# EAGLE design motorcontrol (EAGLE 7.7.0)
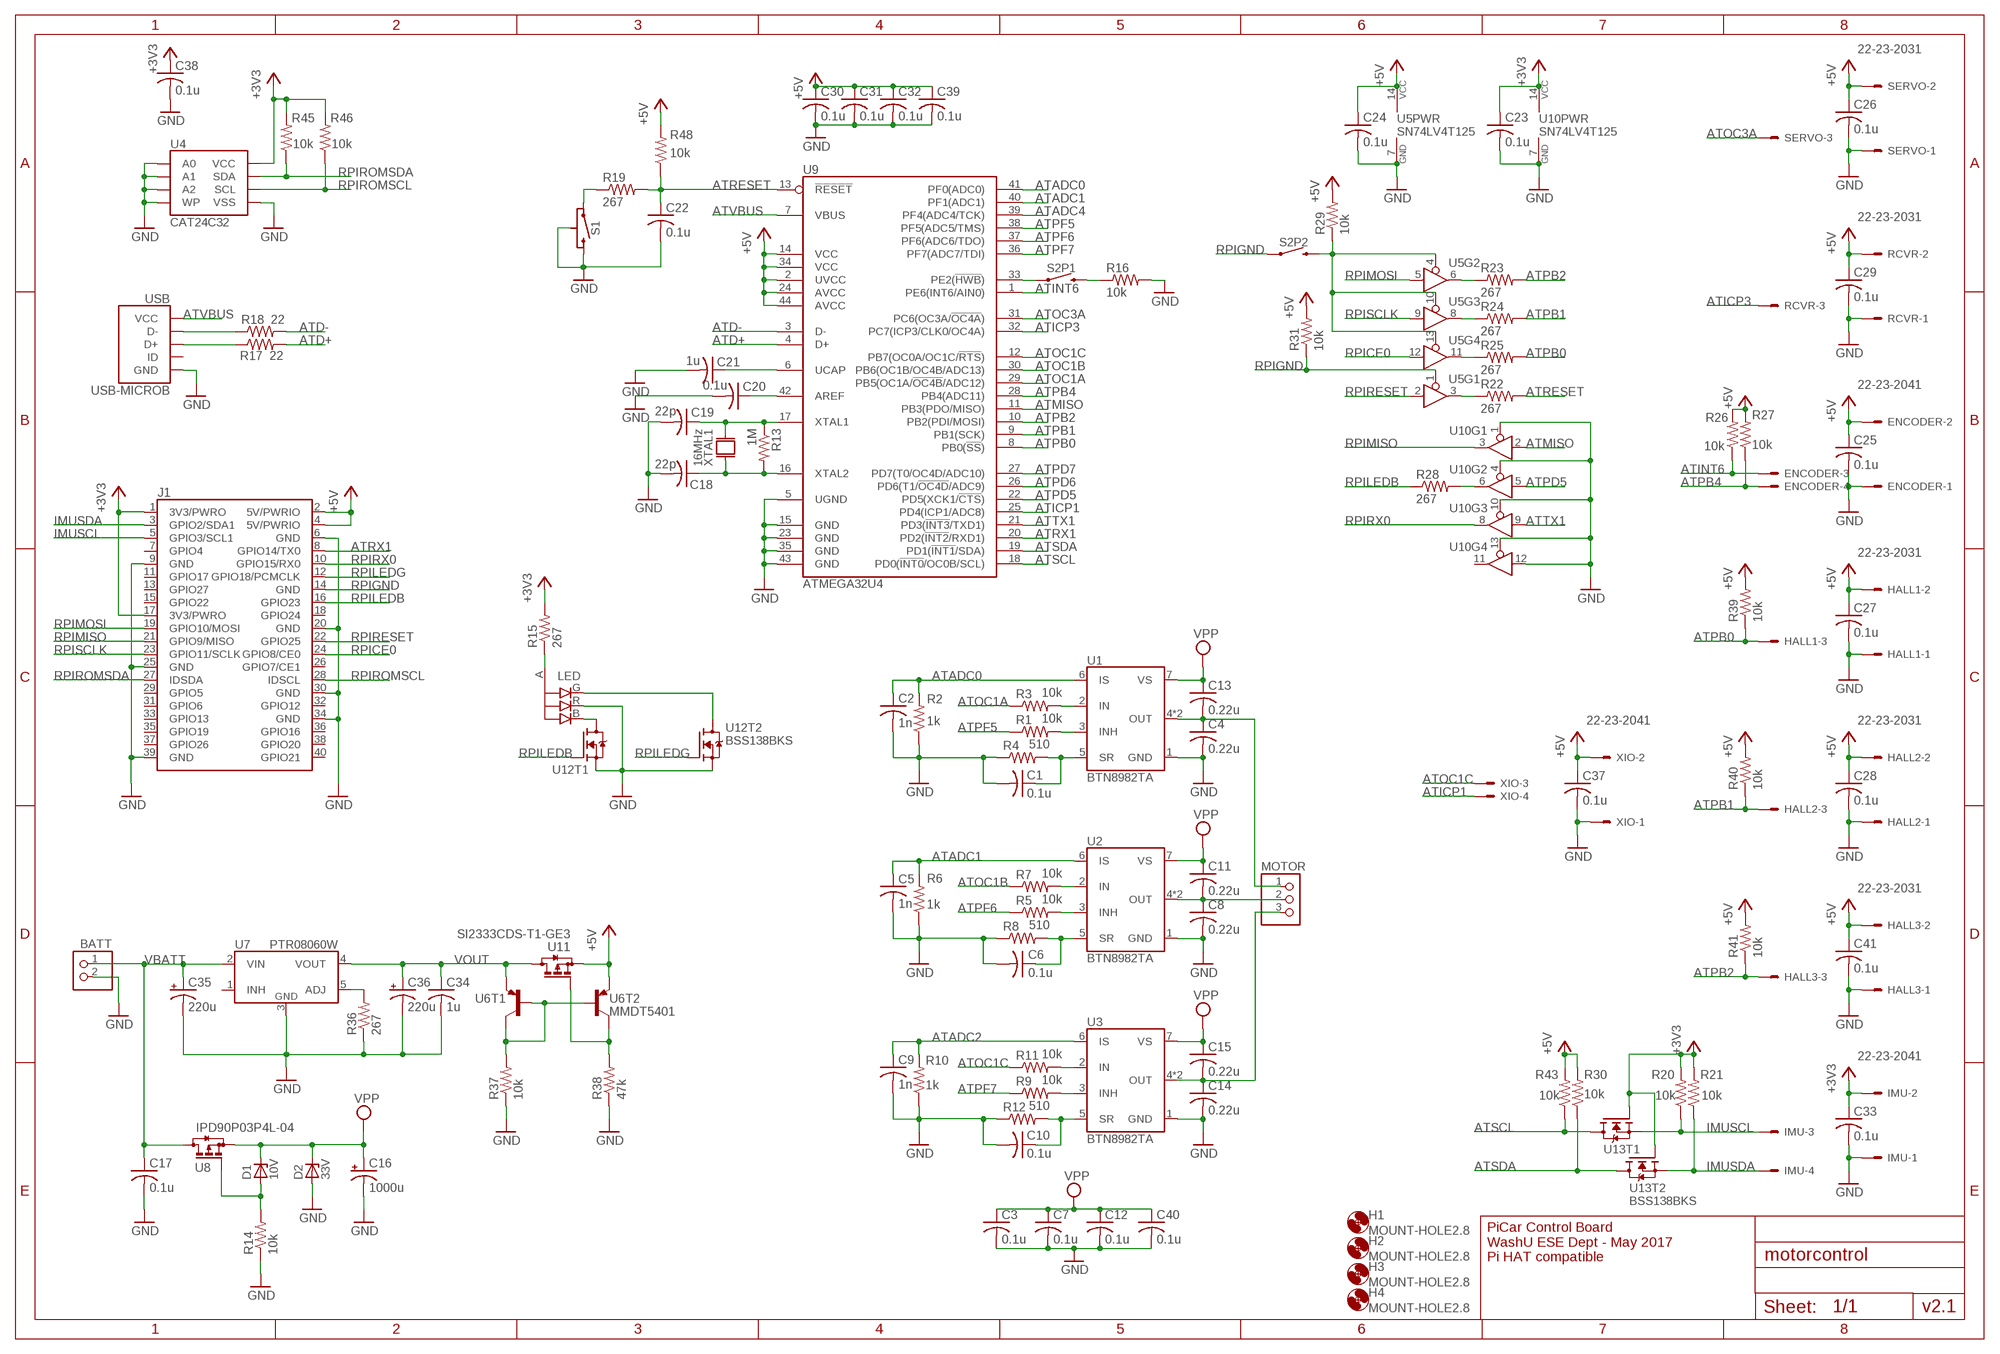
[diagram p0: schematic, sheet 1]

## Parts
BATT  ULTRAFIT_2CIRCVCLIP  [ULTRAFIT_2CIRC_VERTCLIP]
C1  0.1u  C-USC1206  [C1206]
C2  1n  C-USC1206  [C1206]
C3  0.1u  C-USC1206  [C1206]
C4  0.22u  C-USC1206  [C1206]
C5  1n  C-USC1206  [C1206]
C6  0.1u  C-USC1206  [C1206]
C7  0.1u  C-USC1206  [C1206]
C8  0.22u  C-USC1206  [C1206]
C9  1n  C-USC1206  [C1206]
C10  0.1u  C-USC1206  [C1206]
C11  0.22u  C-USC1206  [C1206]
C12  0.1u  C-USC1206  [C1206]
C13  0.22u  C-USC1206  [C1206]
C14  0.22u  C-USC1206  [C1206]
C15  0.22u  C-USC1206  [C1206]
C16  1000u  CPOL-USE5-10.5  [E5-10,5]
C17  0.1u  C-USC1206  [C1206]
C18  22p  C-USC1206  [C1206]
C19  22p  C-USC1206  [C1206]
C20  0.1u  C-USC1206  [C1206]
C21  1u  C-USC1206  [C1206]
C22  0.1u  C-USC1206  [C1206]
C23  0.1u  C-USC1206  [C1206]
C24  0.1u  C-USC1206  [C1206]
C25  0.1u  C-USC1206  [C1206]
C26  0.1u  C-USC1206  [C1206]
C27  0.1u  C-USC1206  [C1206]
C28  0.1u  C-USC1206  [C1206]
C29  0.1u  C-USC1206  [C1206]
C30  0.1u  C-USC1206  [C1206]
C31  0.1u  C-USC1206  [C1206]
C32  0.1u  C-USC1206  [C1206]
C33  0.1u  C-USC1206  [C1206]
C34  1u  C-USC1206  [C1206]
C35  220u  CPOL-USE3.5-8  [E3,5-8]
C36  220u  CPOL-USE3.5-8  [E3,5-8]
C37  0.1u  C-USC1206  [C1206]
C38  0.1u  C-USC1206  [C1206]
C39  0.1u  C-USC1206  [C1206]
C40  0.1u  C-USC1206  [C1206]
C41  0.1u  C-USC1206  [C1206]
D1  10V  ZENER_DIODESOD123  [SOD123]
D2  33V  ZENER_DIODESMA  [SMA]
ENCODER  22-23-2041  [22-23-2041]
H1  MOUNT-HOLE2.8  [2,8]
H2  MOUNT-HOLE2.8  [2,8]
H3  MOUNT-HOLE2.8  [2,8]
H4  MOUNT-HOLE2.8  [2,8]
HALL1  22-23-2031  [22-23-2031]
HALL2  22-23-2031  [22-23-2031]
HALL3  22-23-2031  [22-23-2031]
IMU  22-23-2041  [22-23-2041]
J1  RPIHEADER_2.54-SMD  [RPI_SMD]
LED  LED_3COLOR_COMMONA1411  [150141M173100]
MOTOR  ULTRAFIT_3CIRCVCLIP  [ULTRAFIT_3CIRC_VERTCLIP]
R1  10k  R-US_R1206  [R1206]
R2  1k  R-US_R1206  [R1206]
R3  10k  R-US_R1206  [R1206]
R4  510  R-US_R1206  [R1206]
R5  10k  R-US_R1206  [R1206]
R6  1k  R-US_R1206  [R1206]
R7  10k  R-US_R1206  [R1206]
R8  510  R-US_R1206  [R1206]
R9  10k  R-US_R1206  [R1206]
R10  1k  R-US_R1206  [R1206]
R11  10k  R-US_R1206  [R1206]
R12  510  R-US_R1206  [R1206]
R13  1M  R-US_R1206  [R1206]
R14  10k  R-US_R1206  [R1206]
R15  267  R-US_R1206  [R1206]
R16  10k  R-US_R1206  [R1206]
R17  22  R-US_R1206  [R1206]
R18  22  R-US_R1206  [R1206]
R19  267  R-US_R1206  [R1206]
R20  10k  R-US_R1206  [R1206]
R21  10k  R-US_R1206  [R1206]
R22  267  R-US_R1206  [R1206]
R23  267  R-US_R1206  [R1206]
R24  267  R-US_R1206  [R1206]
R25  267  R-US_R1206  [R1206]
R26  10k  R-US_R1206  [R1206]
R27  10k  R-US_R1206  [R1206]
R28  267  R-US_R1206  [R1206]
R29  10k  R-US_R1206  [R1206]
R30  10k  R-US_R1206  [R1206]
R31  10k  R-US_R1206  [R1206]
R36  267  R-US_R1206  [R1206]
R37  10k  R-US_R1206  [R1206]
R38  47k  R-US_R1206  [R1206]
R39  10k  R-US_R1206  [R1206]
R40  10k  R-US_R1206  [R1206]
R41  10k  R-US_R1206  [R1206]
R43  10k  R-US_R1206  [R1206]
R45  10k  R-US_R1206  [R1206]
R46  10k  R-US_R1206  [R1206]
R48  10k  R-US_R1206  [R1206]
RCVR  22-23-2031  [22-23-2031]
S1  SWITCH-GND  [B3F-312X]
S2  A6HF-2DIP  [A6HF-2DIP]
SERVO  22-23-2031  [22-23-2031]
U1  BTN8982TA  [TO263-7]
U2  BTN8982TA  [TO263-7]
U3  BTN8982TA  [TO263-7]
U4  CAT24C32  [SOIC8]
U5  SN74LV4T125  [TSSOP14]
U6  MMDT5401  [SOT363]
U7  PTR08060W  [EDP_MODULE]
U8  IPD90P03P4L-04  [TO252-3-11]
U9  ATMEGA32U4  [TQFP44]
U10  SN74LV4T125  [TSSOP14]
U11  SI2333CDS-T1-GE3  [SOT23-3]
U12  BSS138BKS  [SOT363]
U13  BSS138BKS  [SOT363]
USB  USB-MICROB  [FCI-10103594-0001LF]
XIO  22-23-2041  [22-23-2041]
XTAL1  16MHz  XTALABLS7M2  [ABLS7M2]

## Nets
+3V3: C23.1 C33.1 C38.1 IMU.2 J1.1(3V3/PWRO) J1.17(3V3/PWRO) R15.2 R20.2 R21.2 R45.2 R46.2 U4.8(VCC) U10.14(PWR:VCC) U13.2(T1:G) U13.5(T2:G)
+5V: C24.1 C25.1 C26.1 C27.1 C28.1 C29.1 C30.1 C31.1 C32.1 C37.1 C39.1 C41.1 ENCODER.2 HALL1.2 HALL2.2 HALL3.2 J1.2(5V/PWRIO) J1.4(5V/PWRIO) R26.2 R27.2 R29.2 R30.2 R31.2 R39.2 R40.2 R41.2 R43.2 R48.2 RCVR.2 SERVO.2 U5.14(PWR:VCC) U6.4(T2:E) U9.2(UVCC) U9.14(VCC) U9.24(AVCC) U9.34(VCC) U9.44(AVCC) U11.2(S) XIO.2
ATADC0: C2.1 R2.2 U1.6(IS) U9.41(PF0(ADC0))
ATADC1: C5.1 R6.2 U2.6(IS) U9.40(PF1(ADC1))
ATADC2: C9.1 R10.2 U3.6(IS)
ATADC4: U9.39(PF4(ADC4/TCK))
ATD+: R17.2 U9.4(D+)
ATD-: R18.2 U9.3(D-)
ATICP1: U9.25(PD4(ICP1/ADC8)) XIO.4
ATICP3: RCVR.3 U9.32(PC7(ICP3/CLK0/OC4A))
ATINT6: ENCODER.3 R26.1 U9.1(PE6(INT6/AIN0))
ATMISO: U9.11(PB3(PDO/MISO)) U10.2(I)
ATOC1A: R3.1 U9.29(PB5(OC1A/!OC4B!/ADC12))
ATOC1B: R7.1 U9.30(PB6(OC1B/OC4B/ADC13))
ATOC1C: R11.1 U9.12(PB7(OC0A/OC1C/!RTS!)) XIO.3
ATOC3A: SERVO.3 U9.31(PC6(OC3A/!OC4A!))
ATPB0: HALL1.3 R25.2 R39.1 U9.8(PB0(!SS!))
ATPB1: HALL2.3 R24.2 R40.1 U9.9(PB1(SCK))
ATPB2: HALL3.3 R23.2 R41.1 U9.10(PB2(PDI/MOSI))
ATPB4: ENCODER.4 R27.1 U9.28(PB4(ADC11))
ATPD5: U9.22(PD5(XCK1/!CTS!)) U10.5(I)
ATPD6: U9.26(PD6(T1/!OC4D!/ADC9))
ATPD7: U9.27(PD7(T0/OC4D/ADC10))
ATPF5: R1.1 U9.38(PF5(ADC5/TMS))
ATPF6: R5.1 U9.37(PF6(ADC6/TDO))
ATPF7: R9.1 U9.36(PF7(ADC7/TDI))
ATRESET: C22.1 R19.2 R22.2 R48.1 U9.13(!RESET!)
ATRX1: J1.8(GPIO14/TX0) U9.20(PD2(!INT2!/RXD1))
ATSCL: R43.1 U9.18(PD0(!INT0!/OC0B/SCL)) U13.6(T1:D)
ATSDA: R30.1 U9.19(PD1(!INT1!/SDA)) U13.3(T2:D)
ATTX1: U9.21(PD3(!INT3!/TXD1)) U10.9(I)
ATVBUS: U9.7(VBUS) USB.1(VCC)
GND: BATT.2 C1.2 C2.2 C3.2 C4.2 C5.2 C6.2 C7.2 C8.2 C9.2 C10.2 C12.2 C14.2 C16.- C17.2 C18.2 C19.2 C20.2 C21.2 C22.2 C23.2 C24.2 C25.2 C26.2 C27.2 C28.2 C29.2 C30.2 C31.2 C32.2 C33.2 C34.2 C35.- C36.- C37.2 C38.2 C39.2 C40.2 C41.2 D2.A ENCODER.1 HALL1.1 HALL2.1 HALL3.1 IMU.1 J1.6(GND) J1.9(GND) J1.20(GND) J1.25(GND) J1.30(GND) J1.34(GND) J1.39(GND) LED.R R2.1 R4.1 R6.1 R8.1 R10.1 R12.1 R14.1 R16.2 R36.1 R37.1 R38.1 RCVR.1 S1.2 S1.3(GND) S1.4(GND) SERVO.1 U1.1(GND) U2.1(GND) U3.1(GND) U4.1(A0) U4.2(A1) U4.3(A2) U4.4(VSS) U4.7(WP) U5.7(PWR:GND) U7.3(GND) U9.5(UGND) U9.15(GND) U9.23(GND) U9.35(GND) U9.43(GND) U10.1(OE) U10.4(OE) U10.7(PWR:GND) U10.10(OE) U10.12(I) U10.13(OE) U12.1(T1:S) U12.4(T2:S) USB.5(GND) USB.GND1(GND) USB.GND2(GND) USB.GND3(GND) USB.GND4(GND) XIO.1
IMUSCL: IMU.3 J1.5(GPIO3/SCL1) R20.1 U13.1(T1:S)
IMUSDA: IMU.4 J1.3(GPIO2/SDA1) R21.1 U13.4(T2:S)
N$1: R1.2 U1.3(INH)
N$2: R38.2 U6.3(T2:C) U11.1(G)
N$3: C19.1 R13.1 U9.17(XTAL1) XTAL1.2
N$4: R3.2 U1.2(IN)
N$5: C6.1 R8.2 U2.5(SR)
N$6: R5.2 U2.3(INH)
N$7: C18.1 R13.2 U9.16(XTAL2) XTAL1.1
N$8: S2.P1.1 U9.33(PE2(!HWB!))
N$9: R7.2 U2.2(IN)
N$10: LED.A R15.1
N$11: R28.2 U10.6(O)
N$12: R16.1 S2.P1.2
N$13: R37.2 U6.2(T1:B) U6.5(T2:B) U6.6(T1:C)
N$14: LED.B U12.6(T1:D)
N$15: R9.2 U3.3(INH)
N$16: R18.1 USB.2(D-)
N$17: R11.2 U3.2(IN)
N$18: R22.1 U5.3(O)
N$19: C20.1 U9.42(AREF)
N$20: C21.1 U9.6(UCAP)
N$21: D1.A R14.2 U8.1(G)
N$22: LED.G U12.3(T2:D)
N$23: R19.1 S1.1
N$24: C1.1 R4.2 U1.5(SR)
N$25: R17.1 USB.3(D+)
N$26: C10.1 R12.2 U3.5(SR)
N$27: R23.1 U5.6(O)
N$28: R24.1 U5.8(O)
N$29: R25.1 U5.11(O)
N$41: R36.2 U7.5(ADJ)
OUT1: C4.1 C13.2 MOTOR.1 U1.4(OUT) U1.8(OUT)
OUT2: C8.1 C11.2 MOTOR.2 U2.4(OUT) U2.8(OUT)
OUT3: C14.1 C15.2 MOTOR.3 U3.4(OUT) U3.8(OUT)
RPICE0: J1.24(GPIO8/CE0) U5.12(I)
RPIGND: J1.14(GND) R31.1 S2.P2.1 U5.1(OE)
RPILEDB: J1.16(GPIO23) R28.1 U12.2(T1:G)
RPILEDG: J1.12(GPIO18/PCMCLK) U12.5(T2:G)
RPIMISO: J1.21(GPIO9/MISO) U10.3(O)
RPIMOSI: J1.19(GPIO10/MOSI) U5.5(I)
RPIRESET: J1.22(GPIO25) U5.2(I)
RPIROMSCL: J1.28(IDSCL) R46.1 U4.6(SCL)
RPIROMSDA: J1.27(IDSDA) R45.1 U4.5(SDA)
RPIRX0: J1.10(GPIO15/RX0) U10.8(O)
RPISCLK: J1.23(GPIO11/SCLK) U5.9(I)
U5OE: R29.1 S2.P2.2 U5.4(OE) U5.10(OE) U5.13(OE)
VBATT: BATT.1 C17.1 C35.+ U7.2(VIN) U8.2(D)
VOUT: C34.1 C36.+ U6.1(T1:E) U7.4(VOUT) U11.3(D)
VPP: C3.1 C7.1 C11.1 C12.1 C13.1 C15.1 C16.+ C40.1 D1.C D2.C U1.7(VS) U2.7(VS) U3.7(VS) U8.3(S)
Unconnected: J1.7(GPIO4) J1.11(GPIO17) J1.13(GPIO27) J1.15(GPIO22) J1.18(GPIO24) J1.26(GPIO7/CE1) J1.29(GPIO5) J1.31(GPIO6) J1.32(GPIO12) J1.33(GPIO13) J1.35(GPIO19) J1.36(GPIO16) J1.37(GPIO26) J1.38(GPIO20) J1.40(GPIO21) U7.1(INH) U10.11(O) USB.4(ID)

## Notes on the sheet
- PiCar Control Board
  WashU ESE Dept - May 2017
  Pi HAT compatible
- v2.1

## Library data of the parts
BATT = rpibout:ULTRAFIT_2CIRC: Molex Ultra-Fit, 3.50mm Pitch, Single Row, 2 Circuits
C1-C15 C17-C34 C37-C41 = resistor:C-US: CAPACITOR, American symbol
C16 C35 C36 = resistor:CPOL-US: POLARIZED CAPACITOR, American symbol
D1 D2 = rpibout:ZENER_DIODE: Zener Diode
ENCODER IMU XIO = con-molex:22-23-2041: .100" (2.54mm) Center Header - 4 Pin; MF: MOLEX; MPN: 22-23-2041; OC_FARNELL: 1462920; OC_NEWARK: 38C0355
H1-H4 = holes:MOUNT-HOLE: MOUNTING HOLE with drill center marker
HALL1-HALL3 RCVR SERVO = con-molex:22-23-2031: .100" (2.54mm) Center Header - 3 Pin; MF: MOLEX; MPN: 22-23-2031; OC_FARNELL: 1462950; OC_NEWARK: 30C0862
J1 = rpibout:RPIHEADER: PIN HEADER
LED = rpibout:LED_3COLOR_COMMONA: MSL0201RGB Right Angle SMD RGB LED
MOTOR = rpibout:ULTRAFIT_3CIRC: Molex Ultra-Fit, 3.50mm Pitch, Single Row, 3 Circuits
R1-R31 R36-R41 R43 R45 R46 R48 = resistor:R-US_: RESISTOR, American symbol
S1 = rpibout:SWITCH-GND: B3U Ultra-small Switch, side actuated, with boss
S2 = rpibout:A6HF-2DIP: 2 Port Slide DIP Switch
U1-U3 = rpibout:BTN8982TA: BTN8982TA High Current PN Half Bridge
U4 = rpibout:CAT24C32: CAT24C32 32Kb EEPROM, SOIC-8 package
U5 U10 = rpibout:SN74LV4T125: SN74LV4T125 Level Translator
U6 = rpibout:MMDT5401: Dual PNP Small Signal Transistor
U7 = rpibout:PTR08060W: PTR08060W Texas Instruments Buck Power Module
U8 = rpibout:IPD90P03P4L-04: IPD90P03P4L-04 P-Channel MOSFET
U9 = rpibout:ATMEGA32U4: ATMEL Mega 32U4 Microcontroller
U11 = rpibout:SI2333CDS-T1-GE3: SI2333CDS-T1-GE3 P-Channel MOSFET
U12 U13 = rpibout:BSS138BKS: BSS138BKS Dual N-MOSFET
USB = rpibout:USB-MICROB: USB Receptable
XTAL1 = rpibout:XTAL: Crystal

## Net classes
1 pwr: width 0.305 mm
3 vcc: width 0.152 mm, drill 0.305 mm, clearance 0.152 mm

## Board
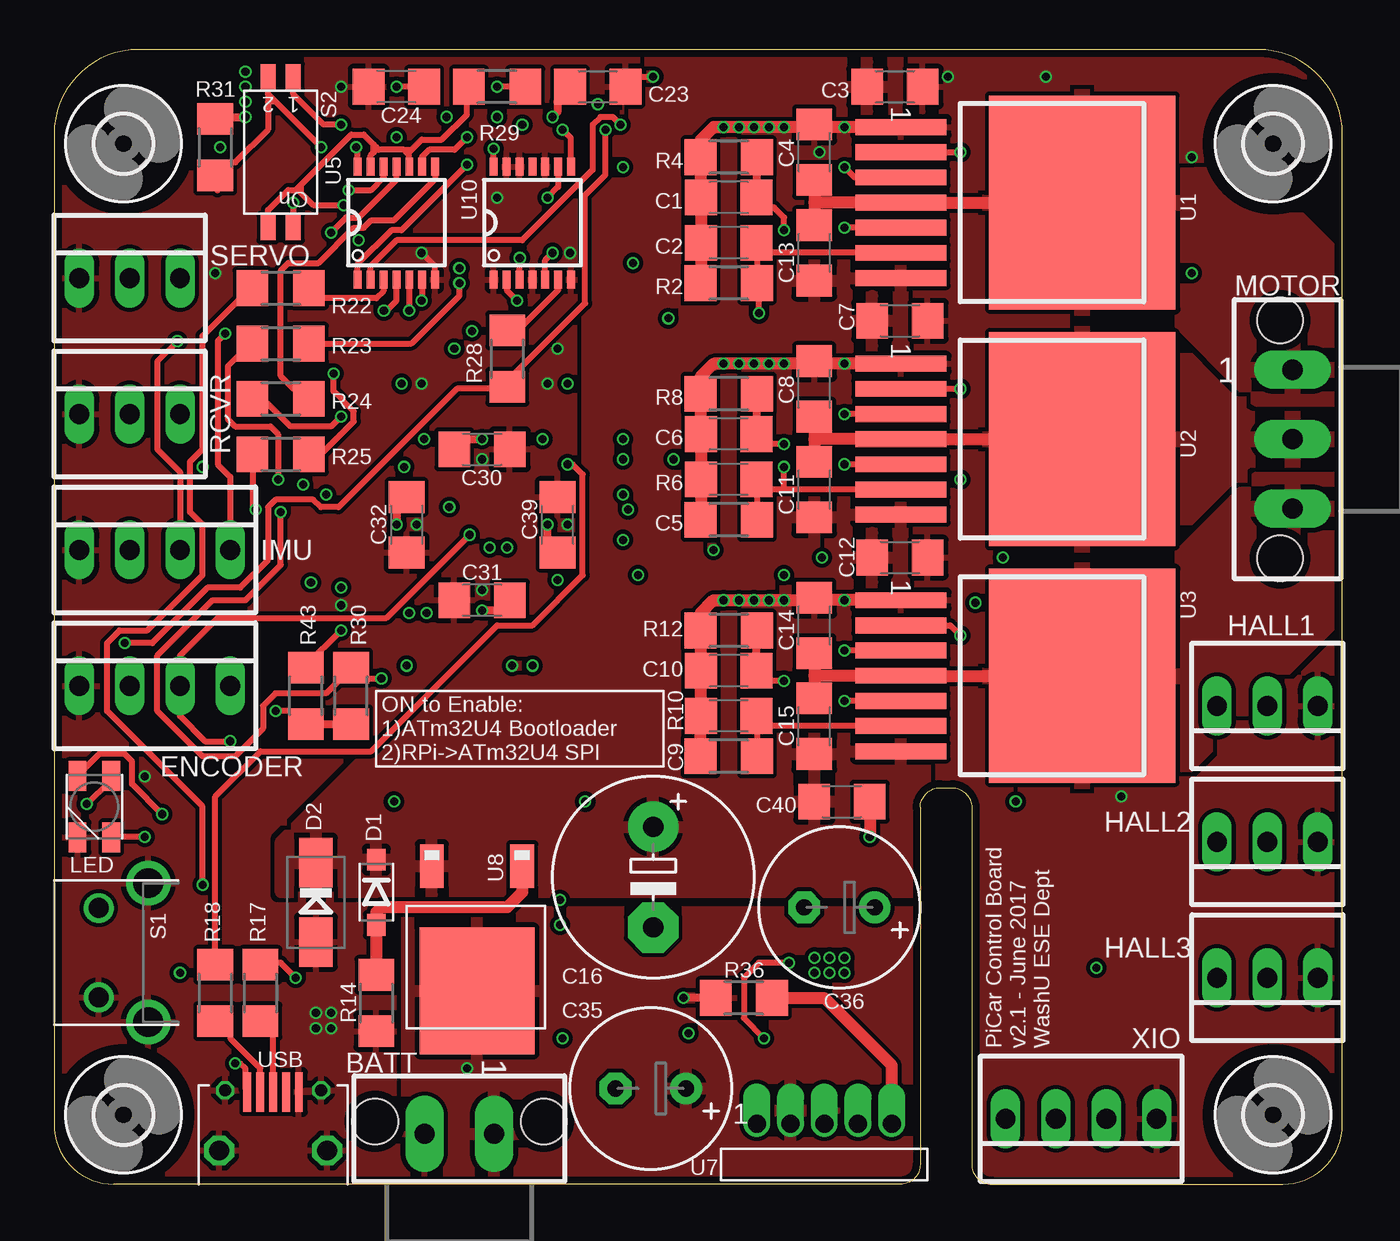
[diagram p1: board, top side]
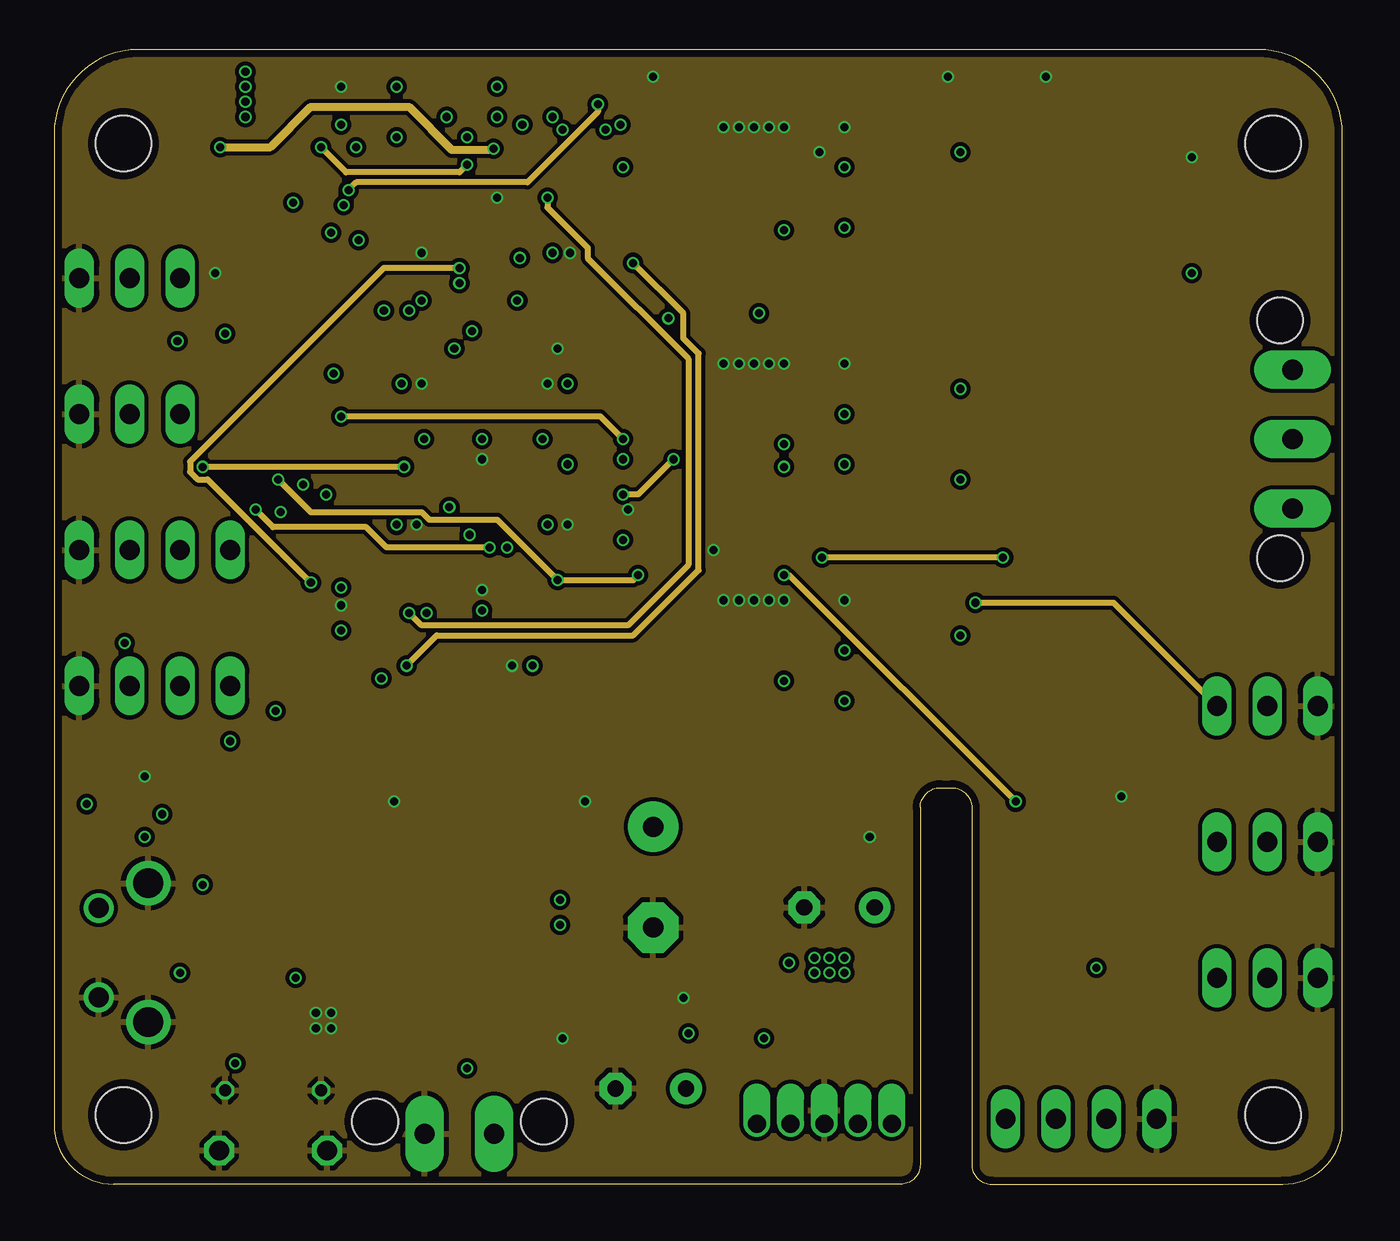
[diagram p2: board, inner layer Route2]
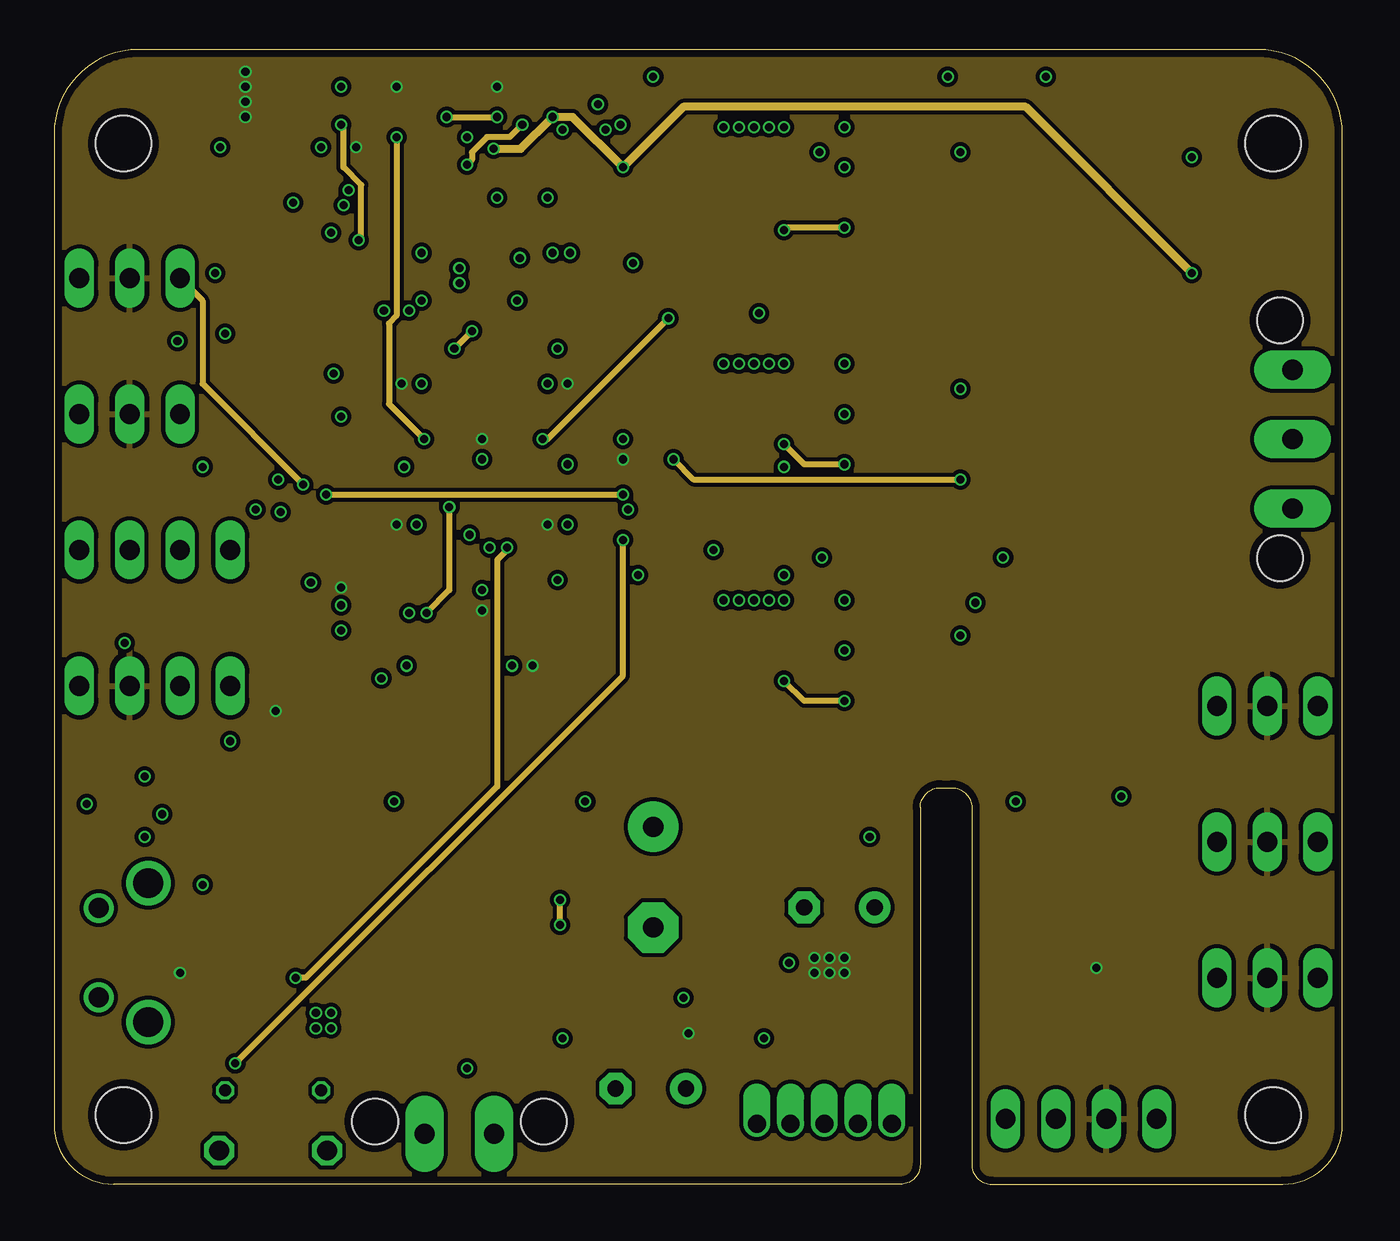
[diagram p3: board, inner layer Route15]
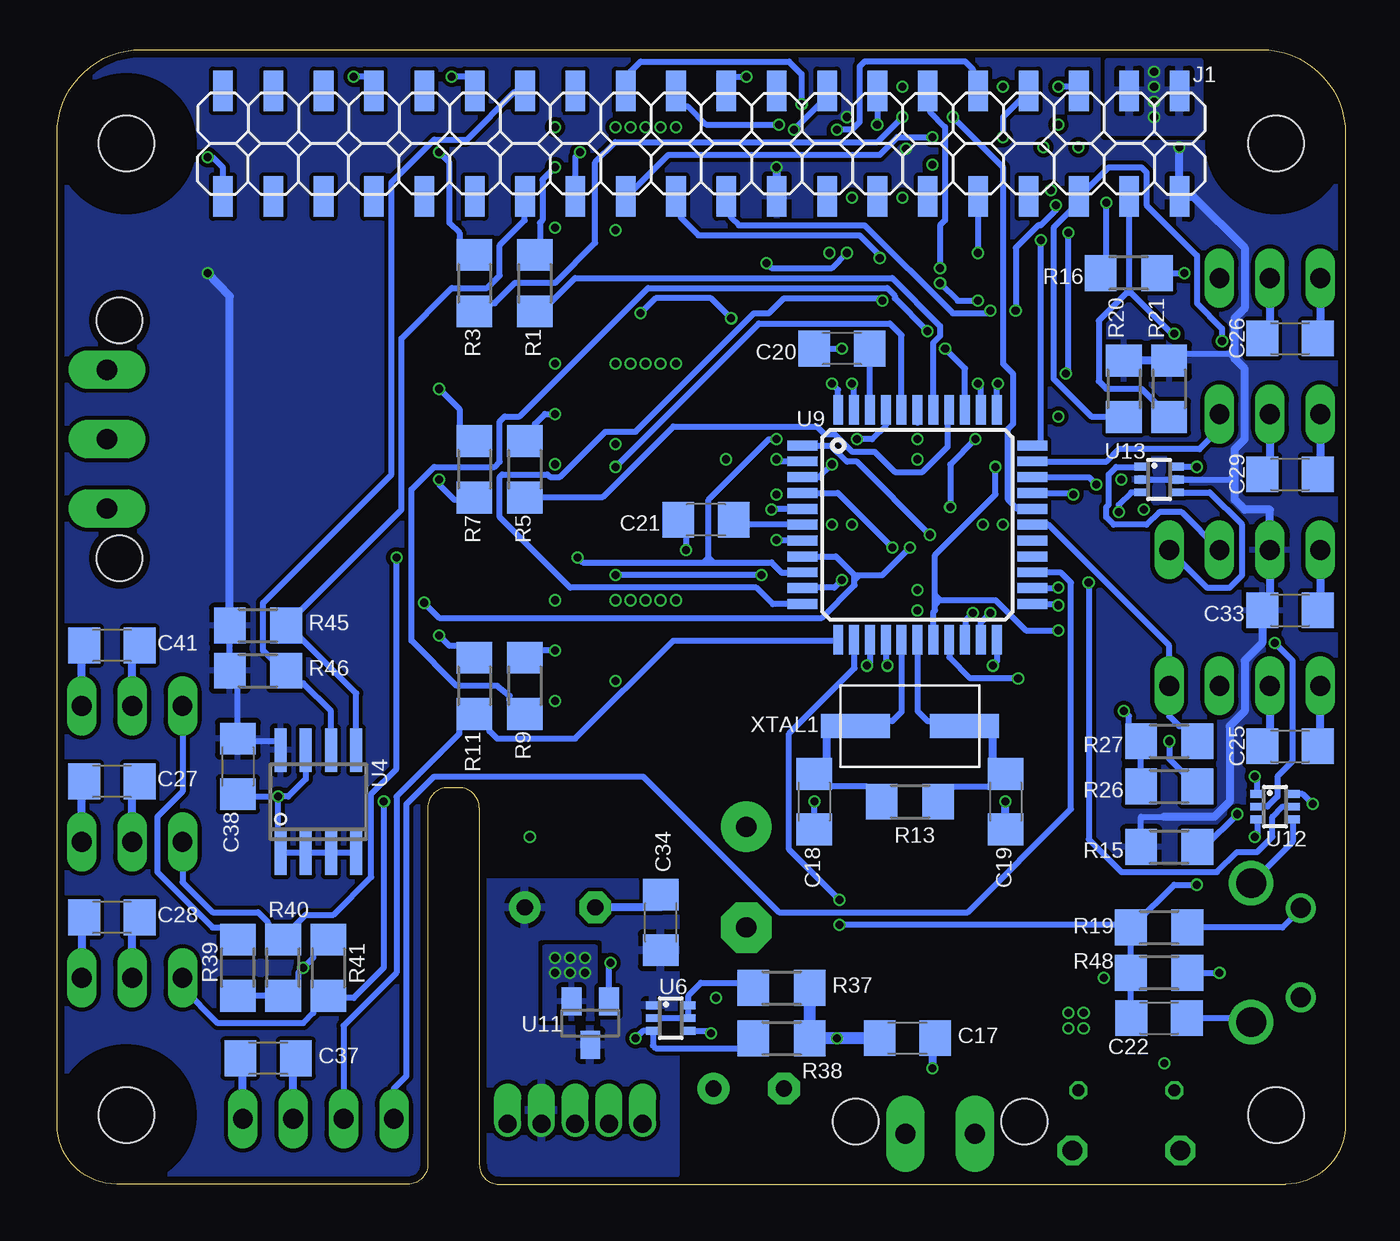
[diagram p4: board, bottom side, seen from below]

Size 65 x 57.25 mm. Coordinates in mm from the lower left corner, seen from the top.
Outline: 65,3 65,53 arc90 60.75,57.25 4.25,57.25 arc90 0,53 0,3 arc90 3,0 42.7,0 arc90 43.7,1 43.7,19 arc-90 44.7,20 45.3,20 arc-90 46.3,19 46.3,1 arc90 47.3,0 62,0 arc90 65,3
Copper layers (1*2*15*16): Top 0.035559375mm / dielectric 0.17018125mm / Route2 0.01778125mm / dielectric 47mil / Route15 0.01778125mm / dielectric 0.17018125mm / Bottom 0.035559375mm
Design rules "OSHPark-4layer *": minimum track width 12mil, minimum drill 16mil, track to track 8mil, track to pad 8mil, pad to pad 8mil, via to via 5mil, smd to smd 5mil, copper to edge 15mil, drill to drill 6mil, minimum pad ring 4mil, minimum via ring 4mil, stop-mask expansion 2.5mil, vias tented up to drill 0mil, thermal gap 10mil

### Footprints (pad centres in the part's own frame; a part is rotated, then mirrored left to right if it is on the bottom)
ULTRAFIT_2CIRC_VERTCLIP = drill 1.02 pad 1.93 long: 1 -1.75,0; 2 1.75,0 | hole 2.3: -4.25,-0.63; 4.25,-0.63
C1206 = smd 1.6 x 1.8: 1 -1.4,0; 2 1.4,0
E5-10,5 = drill 1.016 pad 2.54: + -2.54,0 | drill 1.016 pad 2.54 octagon: - 2.54,0
E3,5-8 = drill 0.813 pad 1.6: + -1.778,0 | drill 0.813 pad 1.6 octagon: - 1.778,0
SOD123 = smd 1.1 x 0.95: A 1.645,0; C -1.645,0
SMA = smd 2.5 x 1.7: A 2,0; C -2,0
22-23-2041 = drill 1 long: 1 -3.81,0; 2 -1.27,0; 3 1.27,0; 4 3.81,0
2,8 = hole 2.8: 0,0
22-23-2031 = drill 1 long: 1 -2.54,0; 2 0,0; 3 2.54,0
RPI_SMD = smd 0.991 x 2.032 bottom: 1 -24.13,-2.667; 2 -24.13,2.667; 3 -21.59,-2.667; 4 -21.59,2.667; 5 -19.05,-2.667; 6 -19.05,2.667; 7 -16.51,-2.667; 8 -16.51,2.667; 9 -13.97,-2.667; 10 -13.97,2.667; 11 -11.43,-2.667; 12 -11.43,2.667; 13 -8.89,-2.667; 14 -8.89,2.667; 15 -6.35,-2.667; 16 -6.35,2.667; 17 -3.81,-2.667; 18 -3.81,2.667; 19 -1.27,-2.667; 20 -1.27,2.667; 21 1.27,-2.667; 22 1.27,2.667; 23 3.81,-2.667; 24 3.81,2.667; 25 6.35,-2.667; 26 6.35,2.667; 27 8.89,-2.667; 28 8.89,2.667; 29 11.43,-2.667; 30 11.43,2.667; 31 13.97,-2.667; 32 13.97,2.667; 33 16.51,-2.667; 34 16.51,2.667; 35 19.05,-2.667; 36 19.05,2.667; 37 21.59,-2.667; 38 21.59,2.667; 39 24.13,-2.667; 40 24.13,2.667
150141M173100 = smd 1.5 x 0.9: A 1.55,0.85; B 1.55,-0.85; G -1.55,-0.85; R -1.55,0.85
ULTRAFIT_3CIRC_VERTCLIP = drill 1.02 pad 1.93 long: 1 -3.5,0; 2 0,0; 3 3.5,0 | hole 2.3: -6,-0.63; 6,-0.63
R1206 = smd 1.6 x 1.803: 1 -1.422,0; 2 1.422,0
B3F-312X = drill 1: 1 -2.25,2.25; 2 2.25,2.25 | drill 1.5: 3 -3.5,4.75; 4 3.5,4.75
A6HF-2DIP = smd 0.76 x 1.27: P1.1 -0.635,-3.81; P1.2 -0.635,3.81; P2.1 0.635,-3.81; P2.2 0.635,3.81
TO263-7 = smd 4.6 x 0.8: 1 -3,3.81; 2 -3,2.54; 3 -3,1.27; 4 -3,0; 5 -3,-1.27; 6 -3,-2.54; 7 -3,-3.81 | smd 9.4 x 10.8: 8 6.15,0
SOIC8 = smd 0.6 x 2.2: 1 -1.905,-2.6; 2 -0.635,-2.6; 3 0.635,-2.6; 4 1.905,-2.6; 5 1.905,2.6; 6 0.635,2.6; 7 -0.635,2.6; 8 -1.905,2.6
TSSOP14 = smd 0.9 x 0.4: 1 -2.875,1.95; 2 -2.875,1.3; 3 -2.875,0.65; 4 -2.875,0; 5 -2.875,-0.65; 6 -2.875,-1.3; 7 -2.875,-1.95; 8 2.825,-1.95; 9 2.825,-1.3; 10 2.825,-0.65; 11 2.825,0; 12 2.825,0.65; 13 2.825,1.3; 14 2.825,1.95
SOT363 = smd 0.4 x 0.7: 1 -0.65,-0.9; 2 0,-0.9; 3 0.65,-0.9; 4 0.65,0.9; 5 0,0.9; 6 -0.65,0.9
EDP_MODULE = drill 0.9 offset: 1 3.404,0; 2 1.702,0; 3 0,0; 4 -1.702,0; 5 -3.404,0
TO252-3-11 = smd 1.2 x 2.2: 1 -2.28,-3.1; 3 2.28,-3.1 | smd 5.8 x 6.4: 2 0,3.2
TQFP44 = smd 1.5 x 0.5: 1 -5.8,4; 2 -5.8,3.2; 3 -5.8,2.4; 4 -5.8,1.6; 5 -5.8,0.8; 6 -5.8,0; 7 -5.8,-0.8; 8 -5.8,-1.6; 9 -5.8,-2.4; 10 -5.8,-3.2; 11 -5.8,-4; 23 5.8,-4; 24 5.8,-3.2; 25 5.8,-2.4; 26 5.8,-1.6; 27 5.8,-0.8; 28 5.8,0; 29 5.8,0.8; 30 5.8,1.6; 31 5.8,2.4; 32 5.8,3.2; 33 5.8,4 | smd 0.5 x 1.5: 12 -4,-5.8; 13 -3.2,-5.8; 14 -2.4,-5.8; 15 -1.6,-5.8; 16 -0.8,-5.8; 17 0,-5.8; 18 0.8,-5.8; 19 1.6,-5.8; 20 2.4,-5.8; 21 3.2,-5.8; 22 4,-5.8; 34 4,5.8; 35 3.2,5.8; 36 2.4,5.8; 37 1.6,5.8; 38 0.8,5.8; 39 0,5.8; 40 -0.8,5.8; 41 -1.6,5.8; 42 -2.4,5.8; 43 -3.2,5.8; 44 -4,5.8
SOT23-3 = smd 1 x 1.4: 1 -0.95,-1.1; 2 0.95,-1.1; 3 0,1.1
FCI-10103594-0001LF = smd 0.4 x 2: 1 -1.3,4.65; 2 -0.65,4.65; 3 0,4.65; 4 0.65,4.65; 5 1.3,4.65 | drill 1 octagon: GND1 -2.725,1.7; GND2 2.725,1.7 | drill 0.6 octagon: GND3 -2.425,4.73; GND4 2.425,4.73
ABLS7M2 = smd 3.5 x 1.2: 1 -2.75,0; 2 2.75,0

### Placement (x,y rotation side)
BATT  20.45,2.54 180 top
C1  34.04,49.78 180 top
C2  34.04,47.5 180 top
C3  42.42,55.37 0 top
C4  38.35,52.07 90 top
C5  34.04,35.56 180 top
C6  34.04,37.85 180 top
C7  42.67,43.56 0 top
C8  38.35,40.13 90 top
C9  34.04,23.62 180 top
C10  34.04,25.91 180 top
C11  38.35,35.05 90 top
C12  42.67,31.62 0 top
C13  38.35,46.99 90 top
C14  38.35,28.19 90 top
C15  38.35,23.11 90 top
C16  30.23,15.49 270 top
C17  22.1,7.37 180 bottom
C18  26.8,19.3 270 bottom
C19  17.14,19.3 270 bottom
C20  25.4,42.16 180 bottom
C21  32.26,33.53 180 bottom
C22  9.4,8.38 0 bottom
C23  27.43,55.37 0 top
C24  17.27,55.37 180 top
C25  2.79,22.1 0 bottom
C26  2.79,42.67 0 bottom
C27  62.23,20.32 180 bottom
C28  62.23,13.46 180 bottom
C29  2.79,35.81 0 bottom
C30  21.59,37.08 0 top
C31  21.59,29.46 180 top
C32  17.78,33.27 270 top
C33  2.79,28.96 0 bottom
C34  34.54,13.21 90 bottom
C35  30.1,4.83 180 top
C36  39.62,13.97 180 top
C37  54.36,6.35 180 bottom
C38  55.88,21.08 270 bottom
C39  25.4,33.27 90 top
C40  39.75,19.3 0 top
C41  62.23,27.18 180 bottom
D1  16.26,14.73 270 top
D2  13.21,14.22 270 top
ENCODER  5.08,25.15 0 top
H1  3.5,3.5 0 top
H2  3.5,52.5 0 top
H3  61.5,52.5 0 top
H4  61.5,3.5 0 top
HALL1  61.21,24.13 180 top
HALL2  61.21,17.27 180 top
HALL3  61.21,10.41 180 top
IMU  5.08,32 0 top
J1  32.5,52.5 0 top
LED  2.03,19.05 90 top
MOTOR  62.48,37.59 270 top
R1  40.89,45.47 90 bottom
R2  34.04,45.47 0 top
R3  43.94,45.47 90 bottom
R4  34.04,51.82 0 top
R5  41.4,36.07 90 bottom
R6  34.04,33.53 0 top
R7  43.94,36.07 90 bottom
R8  34.04,39.88 0 top
R9  41.4,25.15 90 bottom
R10  34.04,21.59 0 top
R11  43.94,25.15 90 bottom
R12  34.04,27.94 0 top
R13  21.97,19.3 180 bottom
R14  16.26,9.14 90 top
R15  8.89,17.02 180 bottom
R16  10.92,45.97 0 bottom
R17  10.41,9.65 90 top
R18  8.13,9.65 90 top
R19  9.4,12.95 180 bottom
R20  11.18,40.13 90 bottom
R21  8.89,40.13 90 bottom
R22  11.43,45.21 180 top
R23  11.43,42.42 180 top
R24  11.43,39.62 180 top
R25  11.43,36.83 180 top
R26  8.89,20.07 180 bottom
R27  8.89,22.35 180 bottom
R28  22.86,41.66 90 top
R29  22.35,55.37 0 top
R30  14.99,24.64 270 top
R31  8.13,52.32 90 top
R36  34.8,9.4 0 top
R37  28.45,9.91 180 bottom
R38  28.45,7.37 180 bottom
R39  55.88,10.92 270 bottom
R40  53.59,10.92 270 bottom
R41  51.31,10.92 90 bottom
R43  12.7,24.64 270 top
R45  54.86,28.19 180 bottom
R46  54.86,25.91 180 bottom
R48  9.4,10.67 0 bottom
RCVR  3.81,38.86 0 top
S1  0,11.68 270 top
S2  11.43,52.07 180 top
SERVO  3.81,45.72 0 top
U1  45.72,49.53 0 top
U2  45.72,37.59 0 top
U3  45.72,25.65 0 top
U4  51.82,19.3 0 bottom
U5  17.27,48.51 90 top
U6  34.04,8.38 270 bottom
U7  38.86,3.05 180 top
U8  21.34,12.95 180 top
U9  21.59,33.27 0 bottom
U10  24.13,48.51 90 top
U11  38.1,8.13 180 bottom
U12  3.56,19.05 270 bottom
U13  9.4,35.56 270 bottom
USB  11.05,0 0 top
XIO  51.82,3.3 180 top
XTAL1  21.97,23.11 0 bottom

### Tracks (layer width: path | path; a pad name or v marks a point on that pad's centre or on a via)
+3V3  (via drill 0.41)
  Top 0.305: U10.14 v22.18,52.24
  Top 0.406: C23.1 26.03,55.24 25.4,54.61 25.4,54.1 v25.15,53.85
  Route2 0.406: v8.38,52.32 10.92,52.32 12.95,54.36 17.91,54.36 20.07,52.2 22.14,52.2 v22.18,52.24
  Route15 0.406: v57.4,45.97 49.02,54.36 31.75,54.36 v28.7,51.31 26.16,53.85 v25.15,53.85 23.54,52.24 v22.18,52.24
  Bottom 0.305: 5.84,35.56 U13.5 U13.2 | 5.84,35.56 5.59,35.81 | 5.59,35.31 5.84,35.56 | R21.2 8.48,41.55 8.13,41.91 5.84,41.91 | 5.84,41.91 5.59,42.16 | 5.59,41.66 5.84,41.91 | U4.8 53.72,22.23 53.85,22.35 55.75,22.35 C38.1 55.88,25.5 R46.2 R45.2 | R15.2 10.31,18.54 9.14,18.54
  Bottom 0.406: 9.14,18.54 6.6,18.54 5.84,19.3 5.84,23.11 5.08,23.88 5.08,26.42 4.19,27.3 C33.1 3.81,29.34 IMU.2 3.81,34.04 5.08,34.04 5.59,34.54 5.59,35.31 5.59,35.81 5.59,37.08 5.08,37.59 5.08,41.15 5.59,41.66 5.59,42.16 5.59,43.69 5.08,44.2 5.08,47.24 7.67,49.83 J1.1 | R21.2 R20.2 | R45.2 56.29,44.81 v57.4,45.97 | v28.7,51.31 28.7,49.84 J1.17 | 8.38,49.78 v8.38,52.32
  pour Bottom (rank 4): -0.76,58.67 65.79,58.67 65.79,-0.76 -0.76,-0.76
+5V  (via drill 0.41)
  Top 0.305: C32.1 17.78,34.54 17.27,34.04 | C30.1 20.32,37.08 20.83,37.59 | C39.1 25.4,32 24.89,32.51 | U5.14 15.32,52.24 v15.24,52.32 | C24.1 v17.27,55.37 | R29.2 v22.35,55.37 | R43.2 12.7,23.37 12.45,23.37 11.94,23.88 v11.18,23.88
  Top 0.406: 17.27,34.04 v17.27,33.27 | 20.83,37.59 v21.59,37.59 | 24.89,32.51 v24.89,33.27 | C31.1 22.99,29.34 22.61,28.96 v21.59,28.96 | R43.2 R30.2 | R31.2 8.23,53.85 v9.65,53.85
  Bottom 0.305: U9.34 17.59,40.32 v17.53,40.39 | U9.44 25.59,40.07 v25.91,40.39 | U9.2 28.6,36.47 v28.7,36.58 | U9.14 23.99,26.3 v24.13,26.16 | U6.4 32.12,7.73 v32,7.62 | R41.2 51.41,12.34 52.07,11.68 52.07,11.43 v52.58,10.92 52.83,10.67 52.83,10.16 52.93,10.16 R40.2 R39.2 | R26.2 R27.2 10.41,22.35 10.92,22.86 10.92,23.62 v11.18,23.88 | R48.2 v6.35,10.67 | U9.24 14.5,30.07 v14.48,30.1
  Bottom 0.406: HALL3.2 61.21,13.46 60.96,13.72 C28.1 | 61.21,20.57 C27.1 61.21,19.94 HALL2.2 | HALL1.2 61.21,26.79 C41.1 | XIO.2 53.09,6.22 C37.1 | SERVO.2 3.81,43.06 C26.1 | RCVR.2 3.81,36.2 C29.1 | ENCODER.2 3.81,22.48 C25.1
  other vias: 38.35,10.67 38.35,11.43 39.88,11.43 9.65,56.13 9.65,55.37 9.65,54.61 39.12,11.43 39.12,10.67 39.88,10.67
  pour Route15: -0.51,58.42 65.53,58.42 65.53,-0.51 -0.51,-0.51
  pour Bottom (isolate 0.254): 37.85,11.94 40.39,11.94 40.39,8.38 37.85,8.38
  pour Bottom: 7.37,53.09 11.94,53.09 11.94,56.64 7.37,56.64
ATADC0  (via drill 0.41)
  Top 0.305: U1.6 35.46,46.99 | 35.44,46.99 35.46,46.99 | 35.46,46.99 R2.2 35.56,45.47 v35.56,43.94
  Top 0.406: 35.46,46.99 35.46,47.48 C2.1
  Route15 0.305: v24.64,37.59 24.89,37.59 v30.99,43.69
  Bottom 0.305: v35.56,43.94 34.8,44.7 32,44.7 v30.99,43.69 | v24.64,37.59 23.88,37.59 23.19,38.28 U9.41
ATADC1  (via drill 0.41)
  Top 0.305: U2.6 36.83,35.05 | 36.83,35.05 35.46,35.05 | 35.44,35.05 35.46,35.05 | 35.46,35.05 R6.2 | 36.83,35.05 v36.83,36.2
  Top 0.406: 35.46,35.05 35.46,35.54 C5.1
  Bottom 0.305: v36.83,36.2 29.59,43.43 22.99,43.43 22.39,42.84 U9.40
ATADC2
  Top 0.305: U3.6 35.56,23.11 35.44,23.11 | 35.46,23.62 R10.2
  Top 0.406: 35.46,23.62 C9.1 35.44,23.24 35.56,23.11
ATADC4
  Bottom 0.305: 21.59,38.42 U9.39
ATD+  (via drill 0.41)
  Top 0.305: v12.19,10.41 11.43,11.18 10.41,11.18 R17.2
  Route15 0.305: v12.19,10.41 12.7,10.41 22.35,20.07 22.35,31.5 22.86,32 v22.86,32.13
  Bottom 0.305: v22.86,32.13 25.6,34.87 U9.4
ATD-  (via drill 0.41)
  Top 0.305: R18.2 8.13,19.56 10.41,21.84 16,21.84 22.35,28.19 24.13,28.19 26.67,30.73 26.67,35.81 26.16,36.32 v25.91,36.32
  Bottom 0.305: U9.3 26.56,35.67 v25.91,36.32
ATICP1
  Bottom 0.305: XIO.4 48.01,4.83 47.37,5.46 47.37,19.18 45.97,20.57 35.43,20.57 28.57,13.72 19.05,13.72 13.84,18.92 13.84,30.35 14.35,30.86 15.75,30.86 U9.25
ATICP3
  Bottom 0.305: RCVR.3 6.35,38.1 7.37,37.08 11.43,37.08 12.04,36.47 U9.32
ATINT6  (via drill 0.41)
  Top 0.305: v20.95,32.77 16.76,28.57 8.26,28.57 6.35,26.67 ENCODER.3 6.35,23.62 7.62,22.35 v8.89,22.35
  Bottom 0.305: v20.95,32.77 24.64,36.45 25.15,36.45 25.97,37.27 U9.1 | v8.89,22.35 8.89,21.46 7.49,20.07 R26.1
ATMISO  (via drill 0.41)
  Top 0.305: v23.37,44.58 22.83,45.12 U10.2
  Bottom 0.305: v23.37,44.58 23.5,44.7 28.32,44.7 29.08,43.94 29.84,43.94 35.81,37.97 37.34,37.97 39.62,35.69 40.13,35.69 40.26,35.81 42.55,35.81 42.67,35.69 42.67,33.66 39.12,30.1 29.72,30.1 28.89,29.27 U9.11
ATOC1A  (via drill 0.41)
  Route15 0.305: v19.81,53.85 v22.35,53.85
  Bottom 0.305: v19.81,53.85 17.27,51.31 17.27,41.4 16.76,40.89 16.76,38.35 17.02,38.1 17.02,34.54 16.55,34.07 U9.29 | v22.35,53.85 23.62,52.58 36.83,52.58 37.85,51.56 37.85,47.5 39.88,45.47 41.91,45.47 42.93,44.45 43.18,44.45 43.59,44.04 R3.1
ATOC1B  (via drill 0.41)
  Route2 0.305: v31.24,36.58 29.46,34.8 v28.7,34.8
  Route15 0.305: v31.24,36.58 32.26,35.56 v45.72,35.56 | v13.72,34.8 v28.7,34.8
  Bottom 0.305: v45.72,35.56 45.72,35.31 44.96,34.54 43.94,34.54 R7.1 | U9.30 13.79,34.87 v13.72,34.8
ATOC1C
  Bottom 0.305: U9.12 25.65,27.43 33.91,27.43 38.86,22.48 42.8,22.48 43.18,22.86 43.18,23.11 43.79,23.72 R11.1 44.09,23.72 44.7,23.11 44.7,22.73 47.88,19.56 47.88,10.67 50.55,8 XIO.3
ATOC3A  (via drill 0.41)
  Route15 0.305: v12.57,35.31 7.49,40.39 7.49,44.58 SERVO.3
  Bottom 0.305: 12.83,35.56 v12.57,35.31 12.94,35.67 U9.31
ATPB0  (via drill 0.41)
  Top 0.305: v10.16,34.04 10.03,34.16 10.03,36.83 R25.2
  Route2 0.305: v46.48,29.34 53.47,29.34 HALL1.3 | v10.16,34.04 11.05,33.15 15.75,33.15 16.76,32.13 v21.97,32.13
  Bottom 0.305: HALL1.3 58.67,19.81 59.94,18.54 59.94,15.75 57.15,12.95 56.49,12.95 R39.1 | 24.77,30.73 25.7,31.67 U9.8 | 24.77,30.48 24.77,30.23 26.42,28.57 45.72,28.57 v46.48,29.34 | 24.77,30.48 24.77,30.73 | v21.97,32.13 23.37,30.73 24.51,30.73 | 24.77,30.73 24.51,30.73 | 24.51,30.73 24.77,30.48
ATPB1  (via drill 0.41)
  Top 0.305: R24.2 10.01,39.37 10.79,39.37 11.94,38.23 13.97,38.23 v14.48,38.73
  Route2 0.305: v47.88,31.62 v38.73,31.62 | v14.48,38.73 27.56,38.73 v28.7,37.59
  Bottom 0.305: HALL2.3 58.67,15.24 57.15,13.72 54.86,13.72 54.36,13.21 54.36,12.95 54.2,12.95 R40.1 53.59,12.45 52.45,13.59 51.05,13.59 49.15,15.49 49.15,19.68 47.88,20.95 v47.88,31.62 | 32.38,31.37 38.48,31.37 v38.73,31.62 | 32.38,31.37 32.13,31.37 | 32.13,31.37 31.88,31.37 | 31.88,31.37 28.96,31.37 28.45,30.86 27.43,30.86 U9.9 | v28.7,37.59 29.08,37.59 32.13,34.54 32.13,31.62 | 32.13,31.37 32.13,31.62 | 31.88,31.37 32.13,31.62 | 32.13,31.62 32.38,31.37
ATPB2  (via drill 0.41)
  Top 0.305: v11.3,35.56 11.3,37.85 10.92,38.23 9.14,38.23 8.76,38.61 8.76,41.27 9.91,42.42 R23.2
  Route2 0.305: v11.3,35.56 12.95,33.91 18.54,33.91 18.92,33.53 22.35,33.53 v25.4,30.48 29.21,30.48 v29.46,30.73 | v48.51,19.3 37.08,30.73 v36.83,30.73
  Bottom 0.305: R41.1 51.46,9.5 52.07,8.89 52.07,8.64 52.58,8.13 56.9,8.13 58.67,9.91 HALL3.3 | v25.4,30.48 25.78,30.1 27.3,30.1 U9.10 | 51.31,10.03 R41.1 | v48.51,19.3 48.51,10.92 50.04,9.4 51.31,9.4 R41.1 | v29.46,30.73 v36.83,30.73
ATPB4
  Bottom 0.305: U9.28 14.99,33.27 8.89,27.18 ENCODER.4 8.89,23.62 8.38,23.11 8.23,23.11 R27.1 7.49,22.35
ATPD5  (via drill 0.41)
  Top 0.305: U10.5 24.78,46.62 v25.15,46.99
  Route2 0.305: v29.21,46.48 31.75,43.94 31.75,42.67 32.51,41.91 32.51,30.99 29.21,27.69 19.3,27.69 v17.78,26.16
  Bottom 0.305: v25.15,46.99 25.91,46.23 28.96,46.23 v29.21,46.48 | U9.22 17.59,26.35 v17.78,26.16
ATPF5
  Bottom 0.305: R1.1 40.89,44.07 40.51,44.07 38.86,45.72 22.86,45.72 20.45,43.31 20.45,42.8 20.79,42.46 U9.38
ATPF6
  Bottom 0.305: U9.37 20.07,38.99 20.07,37.21 21.34,35.94 22.73,35.94 23.75,36.96 24.89,36.96 25.78,37.85 26.29,37.85 26.67,38.23 33.91,38.23 37.47,34.67 41.4,34.67 R5.1
ATPF7  (via drill 0.41)
  Route15 0.305: v21.08,43.05 v20.19,42.16
  Bottom 0.305: v20.19,42.16 19.19,41.16 U9.36 | v21.08,43.05 22.73,44.7 22.73,44.83 23.11,45.21 35.18,45.21 41.66,38.73 42.42,38.73 42.67,38.48 42.67,36.45 42.93,36.2 45.97,36.2 47.12,35.05 47.12,27.43 44.83,25.15 42.8,25.15 42.16,24.64 42.16,24.38 41.5,23.72 R9.1
ATRESET  (via drill 0.41)
  Top 0.305: v7.49,15.11 7.49,19.05 2.67,23.88 2.67,27.3 3.3,27.94 4.7,27.94 7.49,30.73 7.49,33.27 6.86,33.91 6.86,36.45 7.49,37.08 7.49,42.8 9.91,45.21 R22.2
  Route15 0.305: v25.53,13.08 v25.53,14.35
  Bottom 0.305: C22.1 10.82,8.4 R48.1 R19.2 | v25.53,14.35 28.07,16.89 28.07,22.73 24.77,26.04 24.77,27.56 U9.13 | v25.53,13.08 10.79,13.08 R19.2 | v7.49,15.11 8.64,15.11 10.67,13.08 R19.2
ATRX1  (via drill 0.41)
  Route15 0.305: v18.8,28.83 19.94,29.97 v19.94,34.16 | v18.67,37.59 16.89,39.37 16.89,43.43 17.27,43.81 v17.27,52.83
  Bottom 0.305: v18.8,28.83 19.18,28.45 19.18,27.56 U9.20 | v19.94,34.16 19.94,36.32 v18.67,37.59 | v17.27,52.83 17.27,53.85 16,55.12 J1.8
ATSCL  (via drill 0.41)
  Top 0.305: v14.48,27.94 12.7,26.16 R43.1
  Route2 0.305: v17.65,36.2 v7.49,36.2
  Bottom 0.305: v7.49,36.2 8.38,36.2 U13.6 | v17.65,36.2 17.65,34.8 20.7,31.75 20.7,29.72 | 20.7,29.46 20.7,29.72 | v14.48,27.94 16.13,27.94 17.65,29.46 20.45,29.46 | 20.7,29.46 20.57,29.46 | 20.57,29.46 20.45,29.46 | U9.18 20.79,28.87 20.7,28.96 20.7,29.21 | 20.7,29.21 20.7,29.34 | 20.7,29.34 20.57,29.46 | 20.7,29.72 20.45,29.46 | 20.45,29.46 20.7,29.21 | 20.7,29.34 20.7,29.46
ATSDA  (via drill 0.41)
  Top 0.305: v11.43,33.91 11.43,31.24 9.65,29.46 8,29.46 5.21,26.67 5.21,23.88 7.49,21.59 9.14,21.59 10.54,22.99 10.54,24.13 11.18,24.77 13.72,24.77 14.99,26.04 R30.1 15.11,26.04 15.62,25.53 v16.51,25.53
  Bottom 0.305: v16.51,25.53 18.92,25.53 19.99,26.59 U9.19 | U13.3 10.81,34.91 11.43,34.29 v11.43,33.91
ATTX1  (via drill 0.41)
  Top 0.305: v24.89,49.78 25.43,50.32 U10.9
  Route2 0.305: v17.91,28.83 18.54,28.19 28.96,28.19 32,31.24 32,41.66 26.92,46.74 26.92,47.24 24.89,49.28 v24.89,49.78
  Bottom 0.305: U9.21 18.39,28.35 v17.91,28.83
ATVBUS  (via drill 0.41)
  Top 0.305: v9.14,6.1 9.4,6.1 9.65,5.84 9.65,4.83 USB.1
  Route15 0.305: v28.7,32.51 28.7,25.65 v9.14,6.1
  Bottom 0.305: v28.7,32.51 27.43,32.51 U9.7
GND  (via drill 0.41)
  Top 0.305: C32.2 17.78,32 | C30.2 22.86,37.08 | C39.2 25.4,34.54 | C23.2 28.83,55.5 29.21,55.88 v30.23,55.88 | U5.7 19.22,46.31 v18.54,46.99
  Top 0.406: R36.1 v31.75,9.4
  Top 0.61: U3.1 v39.88,29.46 38.48,29.46 | 38.22,29.46 v36.83,29.46 v36.07,29.46 v35.31,29.46 v34.54,29.46 v33.78,29.46 33.27,29.46 32.61,28.8 R12.1 32.61,25.93 | R10.1 32.61,23.6 | C9.2 C10.2 | C4.2 38.22,53.34 v36.83,53.34 v36.07,53.34 v35.31,53.34 v34.54,53.34 v33.78,53.34 33.27,53.34 32.61,52.68 R4.1 32.61,49.81 | C1.2 C2.2 32.64,45.49 | U2.1 v39.88,41.4 38.48,41.4 | C8.2 38.22,41.4 v36.83,41.4 v36.07,41.4 v35.31,41.4 v34.54,41.4 v33.78,41.4 33.27,41.4 32.61,40.74 R8.1 32.61,37.87 | C6.2 C5.2 32.64,33.55 | U1.1 v39.88,53.34 38.48,53.34 | C40.2 v41.15,17.53
  Top 0.813: 38.48,29.46 C14.2 38.22,29.46 | 32.61,25.93 C10.2 | 32.61,23.6 C9.2 | 32.61,49.81 C1.2 | 32.64,45.49 R2.1 | 38.48,41.4 C8.2 | 32.61,37.87 C6.2 | 32.64,33.55 R6.1 | 38.48,53.34 C4.2
  Bottom 0.305: U9.43 24.79,40.28 v24.89,40.39 | U9.5 28.92,34.07 v28.96,34.04 | U9.35 18.39,40.23 v18.54,40.39 | U9.23 14.54,29.27 v14.48,29.21 | v33.27,32 33.27,33.02 33.66,33.4 C21.2 | C20.2 v25.4,42.16 | C18.2 v26.8,19.3 | U4.4 U4.3 U4.2 U4.1 53.85,16.83 v53.85,19.56 | U12.1 4.46,20.46 v4.57,20.57 | U12.4 2.66,17.28 S1.3 | J1.6 13.45,55.38 v14.48,55.37 | J1.25 38.85,51.83 v38.61,52.07 | J1.30 43.93,55.61 44.2,55.88 v45.09,55.88 | J1.34 49.01,55.61 49.28,55.88 v50.04,55.88 | J1.39 56.63,51.3 57.15,51.82 v57.4,51.82 | J1.20 31.23,55.64 30.99,55.88 v30.23,55.88 | R16.2 v8.13,45.97 | U9.15 23.19,26.24 v23.11,26.16 | C38.2 55.76,19.56 v53.85,19.56 | U4.7 52.45,20.45 53.34,19.56 v53.85,19.56 | C22.2 4.95,8.38 S1.4 | J1.9 18.53,47 v18.54,46.99
  Bottom 0.406: C19.2 v17.14,19.3 | C34.2 34.54,13.97 C36.- | HALL3.1 63.75,13.72 C28.2 | 63.75,20.57 C27.2 63.75,20.2 HALL2.1 | HALL1.1 63.75,27.05 C41.2 | XIO.1 55.63,6.22 C37.2 | SERVO.1 1.27,42.8 C26.2 | RCVR.1 1.27,35.94 C29.2 | IMU.1 1.27,29.08 C33.2 | C25.2 1.27,22.22 ENCODER.1
  Bottom 0.61: C17.2 v25.65,7.37 R38.1 R37.1
  other vias: 18.29,33.27 21.59,29.97 25.91,33.27 21.59,36.58 22.35,49.78 26.04,46.99 13.21,8.64 13.97,8.64 13.97,7.87 13.21,7.87
  pour Route2: -0.25,58.17 65.28,58.17 65.28,-0.25 -0.25,-0.25
  pour Top (rank 6): -1.02,-1.02 -1.02,58.93 66.04,58.93 66.04,-1.02
IMUSCL  (via drill 0.41)
  Top 0.305: IMU.3 6.35,35.94 5.21,37.08 5.21,41.53 v6.22,42.55
  Bottom 0.305: IMU.3 8.26,33.91 9.4,33.91 10.03,33.27 11.68,33.27 12.06,33.66 12.06,34.16 11.94,34.29 11.94,35.81 11.56,36.2 10.41,36.2 U13.1 | R20.1 11.18,38.73 12.83,38.73 14.73,40.64 14.73,48.26 13.46,49.53 13.46,49.78 J1.5 13.34,49.91 11.94,51.31 10.29,51.31 10.03,51.05 10.03,49.4 7.49,46.86 7.49,44.45 6.22,43.18 v6.22,42.55
IMUSDA  (via drill 0.41)
  Top 0.305: IMU.4 8.89,35.69 8.26,36.32 8.26,42.55 v8.64,42.93
  Bottom 0.305: IMU.4 6.99,30.1 5.84,30.1 5.21,30.73 5.21,33.27 6.84,34.91 U13.4 | 10.92,45.09 11.05,44.96 | 11.05,44.96 12.45,43.56 12.45,40.51 12.06,40.13 10.29,40.13 8.89,38.73 R21.1 | 10.92,45.09 10.92,49.78 J1.3 | 10.92,45.09 10.79,44.96 | 10.79,44.96 8.76,42.93 v8.64,42.93 | 10.79,44.96 11.05,44.96
N$1  (via drill 0.41)
  Top 0.305: U1.3 40.39,50.8 v39.88,51.31
  Bottom 0.305: v39.88,51.31 40.51,50.67 40.51,48.64 40.64,48.51 40.64,47.14 R1.2
N$2  (via drill 0.41)
  Top 0.305: v37.08,11.18 35.56,11.18 34.8,10.41 34.8,8.38 v35.81,7.37
  Bottom 0.305: R38.2 30.38,6.86 34.8,6.86 34.94,7 U6.3 35.45,7.73 v35.81,7.37 | U11.1 37.15,11.11 v37.08,11.18
N$3
  Bottom 0.305: U9.17 21.59,23.88 21.08,23.37 19.48,23.37 XTAL1.2 18.97,22.86 17.78,22.86 | 17.78,21.34 C19.1 17.78,20.07 20.07,20.07 20.55,19.58 R13.1
  Bottom 0.406: 17.78,21.34 17.78,22.86
N$4  (via drill 0.41)
  Top 0.305: U1.2 v45.72,52.07
  Bottom 0.305: v45.72,52.07 45.21,51.56 45.21,48.51 44.7,48.01 44.7,47.65 R3.2
N$5  (via drill 0.41)
  Top 0.305: 35.46,37.87 C6.1 | R8.2 35.44,39.88 | U2.5 v39.88,36.32 | v36.83,37.34 35.94,37.34
  Top 0.406: 35.94,37.34 C6.1 | 35.46,37.87 R8.2
  Route15 0.305: v39.88,36.32 37.85,36.32 v36.83,37.34
N$6  (via drill 0.41)
  Top 0.305: U2.3 v39.88,38.86
  Bottom 0.305: R5.2 41.5,37.49 40.89,38.1 40.89,38.35 40.39,38.86 v39.88,38.86
N$7
  Bottom 0.305: U9.16 22.39,23.84 22.86,23.37 24.47,23.37 XTAL1.1 24.98,22.86 26.16,22.86 | 26.16,21.34 C18.1 26.16,20.07 24.13,20.07 23.39,19.33 R13.2
  Bottom 0.406: 26.16,21.34 26.16,22.86
N$8  (via drill 0.41)
  Top 0.305: v14.48,53.47 13.59,53.47 12.06,54.99 S2.P1.1
  Route15 0.305: v14.48,53.47 14.61,53.34 14.61,51.31 15.49,50.42 15.49,47.75 v15.37,47.62
  Bottom 0.305: v15.37,47.62 15.37,37.85 15.37,37.72 15.37,37.27 U9.33
N$9  (via drill 0.41)
  Top 0.305: U2.2 v45.72,40.13
  Bottom 0.305: v45.72,40.13 44.7,39.12 44.7,38.25 R7.2
N$10  (via drill 0.41)
  Top 0.305: v5.46,18.67 3.94,20.19 3.94,21.34 3.56,21.72 2.29,21.72 1.27,20.7 LED.A
  Bottom 0.305: v5.46,18.67 7.11,17.02 R15.1
N$11
  Top 0.305: R28.2 22.86,43.18 23.5,43.18 25.43,45.12 U10.6
N$12  (via drill 0.41)
  Top 0.305: v12.06,49.53 S2.P1.2
  Bottom 0.305: v12.06,49.53 12.06,46.23 12.32,45.97 R16.1
N$13
  Bottom 0.305: U6.2 U6.5 U6.6 33.14,9.54 32.51,10.16 30.12,10.16 R37.2
N$14  (via drill 0.41)
  Top 0.305: v1.65,19.18 2.79,20.32 2.79,20.57 LED.B
  Bottom 0.305: v1.65,19.18 2.16,19.68 2.54,19.68 U12.6
N$15  (via drill 0.41)
  Top 0.305: U3.3 v39.88,26.92
  Bottom 0.305: v39.88,26.92 41.05,26.92 R9.2
N$16
  Top 0.305: USB.2 10.4,5.86 8.89,7.37 8.89,7.62 8.28,8.23 R18.1
N$17  (via drill 0.41)
  Top 0.305: U3.2 45.21,28.19 v45.72,27.69
  Bottom 0.305: v45.72,27.69 45.21,27.18 44.7,27.18 44.7,26.57 R11.2
N$18
  Top 0.305: U5.3 16.62,45.07 16.26,44.7 13.36,44.7 R22.1
N$19
  Bottom 0.305: U9.42 24,39.08 C20.1
N$20
  Bottom 0.305: U9.6 30.6,33.27 C21.1
N$21
  Top 0.61: R14.2 D1.A 16.26,13.72 16.51,13.97 22.86,13.97 23.62,14.73 U8.1
N$22  (via drill 0.41)
  Top 0.305: v4.57,17.53 2.91,17.53 LED.G
  Bottom 0.305: U12.3 4.46,17.64 v4.57,17.53
N$23
  Bottom 0.305: R19.1 3.17,12.95 2.29,13.84 S1.1
N$24  (via drill 0.41)
  Top 0.305: 35.46,49.81 C1.1 | R4.2 35.44,51.82 | U1.5 v39.88,48.26 | v36.83,48.13 36.83,48.77 36.32,49.28 35.94,49.28
  Top 0.406: 35.94,49.28 C1.1 | 35.46,49.81 R4.2
  Route15 0.305: v39.88,48.26 36.96,48.26 v36.83,48.13
N$25
  Top 0.305: USB.3 11.05,7.59 R17.1
N$26  (via drill 0.41)
  Top 0.305: R12.2 35.44,27.94 | U3.5 v39.88,24.38 | v36.83,25.4 35.94,25.4
  Top 0.406: 35.94,25.4 C10.1 35.44,27.92 R12.2
  Route15 0.305: v39.88,24.38 37.85,24.38 v36.83,25.4
N$27  (via drill 0.41)
  Top 0.305: v20.45,45.47 20.45,44.83 18.03,42.42 R23.1 | U5.6 18.57,44.61 v18.54,44.58
  Bottom 0.305: v18.54,44.58 19.56,44.58 v20.45,45.47
N$28
  Top 0.305: R24.1 12.85,40.13 12.06,40.13 11.43,40.77 11.43,46.1 11.81,46.48 13.34,46.48 15.11,48.26 15.62,48.26 16,48.64 17.14,48.64 19.22,50.72 U5.8
N$29  (via drill 0.41)
  Top 0.305: U5.11 17.27,50.67 15.37,48.77 14.73,48.77 v13.97,48.01 | v14.1,40.89 14.1,40.01 15.11,38.99 15.11,38.48 13.46,36.83 R25.1
  Bottom 0.305: v13.97,48.01 13.97,41.02 v14.1,40.89
N$41
  Top 0.61: R36.2 38.86,9.4 42.27,5.99 U7.5
OUT1
  Top 0.61: U1.8 U1.4 38.35,49.53 | C4.1 38.35,49.53 | 38.35,49.53 C13.2
  pour Top: 47.24,54.86 56.64,54.86 64.77,46.74 64.77,39.62 60.71,39.62 56.13,44.2 47.24,44.2
OUT2
  Top 0.61: U2.8 U2.4 38.35,37.59 | C8.1 38.35,37.59 | 38.35,37.59 C11.2
  pour Top (rank 2): 47.24,42.93 56.64,42.93 60.45,39.12 64.77,39.12 64.77,36.07 60.45,36.07 56.64,32.26 47.24,32.26
OUT3
  Top 0.61: U3.8 U3.4 38.35,25.65 | C14.1 38.35,25.65 | 38.35,25.65 C15.2
  pour Top: 47.24,30.99 56.13,30.99 60.71,35.56 64.77,35.56 64.77,28.7 56.39,20.32 47.24,20.32
RPICE0  (via drill 0.41)
  Top 0.305: v14.86,50.16 16,50.16 16.64,50.8 16.64,51.31 U5.12
  Route2 0.305: v14.86,50.16 15.24,50.55 23.88,50.55 27.43,54.1 v27.43,54.48
  Bottom 0.305: v27.43,54.48 27.43,56.01 28.07,56.64 35.56,56.64 36.07,56.13 36.07,55.88 36.31,55.64 J1.24
RPIGND  (via drill 0.41)
  Top 0.305: v20.83,51.44 17.53,48.13 17.02,48.13 15.32,46.44 U5.1 | 10.79,54.99 S2.P2.1 | v13.46,52.32 11.18,54.61 | 11.18,54.61 10.79,54.99 | 8.23,50.14 R31.1 8.23,50.9 8.89,51.56 9.14,51.56 10.79,53.21 10.79,54.61 | 10.79,54.99 10.79,54.61 | 11.18,54.61 10.79,54.61
  Route2 0.305: v13.46,52.32 14.73,51.05 20.45,51.05 v20.83,51.44
  Route15 0.305: v20.83,51.44 21.08,51.69 21.08,52.07 21.84,52.83 22.99,52.83 v23.62,53.47
  Bottom 0.305: v23.62,53.47 23.62,55.12 J1.14
RPILEDB  (via drill 0.41)
  Top 0.305: v3.56,27.3 4.95,27.3 7.75,30.1 9.4,30.1 10.79,31.5 10.79,34.16 11.18,34.54 13.08,34.54 13.46,34.16 14.35,34.16 20.32,40.13 22.86,40.13 R28.1 22.86,40.51 26.8,44.45 26.8,49.91 27.81,50.93 v27.81,53.21
  Bottom 0.305: U12.2 3.94,19.05 3.43,19.56 3.43,20.57 2.67,21.34 2.67,26.42 v3.56,27.3 | v27.81,53.21 26.16,54.86 26.16,55.12 J1.16
RPILEDG  (via drill 0.41)
  Route2 0.305: v12.95,30.35 7.75,35.56 7.24,35.56 6.86,35.94 6.86,36.45 16.64,46.23 v20.45,46.23
  Bottom 0.305: U12.5 3.17,19.05 3.68,18.54 3.68,17.53 4.45,16.76 5.46,16.76 6.48,15.75 11.3,15.75 12.95,17.4 v12.95,30.35 | v20.45,46.23 20.45,48.39 20.19,48.64 20.19,53.34 20.95,54.1 20.95,55.12 J1.12
RPIMISO  (via drill 0.41)
  Top 0.305: U10.3 23.48,46.72 v23.5,46.74
  Bottom 0.305: v23.5,46.74 23.5,46.86 24.51,47.88 32.64,47.88 33.53,48.77 33.53,49.59 J1.21
RPIMOSI  (via drill 0.41)
  Top 0.305: U5.5 17.92,44.08 v17.91,44.07
  Bottom 0.305: v17.91,44.07 18.03,43.94 19.81,43.94 24.26,48.39 30.61,48.39 30.99,48.77 30.99,49.59 J1.19
RPIRESET  (via drill 0.41)
  Top 0.305: v28.57,53.47 28.19,53.85 27.56,53.85 27.18,53.47 27.18,51.18 23.62,47.62 17.27,47.62 15.97,46.33 U5.2
  Bottom 0.305: v28.57,53.47 32.26,53.47 33.15,54.36 33.78,54.36 33.77,54.37 J1.22
RPIROMSCL
  Bottom 0.305: U4.6 51.18,23.88 52.58,25.27 53.34,25.27 53.34,25.91 R46.1 53.59,25.91 54.61,26.92 54.61,29.34 48.13,35.81 48.13,50.55 45.97,52.7 44.32,52.7 41.91,55.12 41.4,55.12 J1.28
RPIROMSDA
  Bottom 0.305: U4.5 49.91,24.77 53.34,28.19 R45.1 53.34,28.32 47.62,34.04 47.62,42.67 45.09,45.21 43.31,45.21 42.67,45.85 42.67,47.37 41.4,48.64 41.4,49.78 J1.27
RPIRX0  (via drill 0.41)
  Top 0.305: v25.65,53.21 26.08,52.79 U10.8
  Bottom 0.305: v25.65,53.21 24.89,53.21 24.51,53.59 24.51,56.39 24.26,56.64 19.18,56.64 18.8,56.26 18.8,55.17 J1.10
RPISCLK  (via drill 0.41)
  Top 0.305: v20.83,52.83 20.19,52.2 18.92,52.2 18.54,51.82 18.54,51.44 U5.9
  Bottom 0.305: v20.83,52.83 22.61,52.83 23.5,51.94 34.16,51.94 36.2,49.91 J1.23
U5OE  (via drill 0.41)
  Top 0.305: 16.26,52.2 16.13,52.07 | 16.13,52.07 15.97,51.91 U5.13 | 17.65,52.2 16.38,52.2 | 16.38,52.2 16.26,52.2 | 17.84,52.01 17.91,51.94 17.91,51.44 U5.10 | 17.84,52.01 17.65,52.2 | U5.4 17.27,44.58 16.76,44.07 v16.64,44.07 | v14.61,49.4 13.08,49.4 12.45,50.04 | 12.32,50.16 12.45,50.04 | 12.19,50.16 11.81,50.16 10.79,49.15 S2.P2.2 | 12.19,50.16 12.32,50.16 | 16.13,52.45 15.62,52.96 14.99,52.96 12.45,50.42 | 16.13,52.45 16.26,52.32 | 12.32,50.29 12.45,50.42 | 16.26,52.32 16.26,52.2 | 12.32,50.29 12.32,50.16 | 17.84,52.01 18.03,52.2 | 18.03,52.2 18.54,52.7 19.56,52.7 20.83,53.98 20.83,55.37 R29.1 | 12.19,50.16 12.32,50.29 | 12.45,50.42 12.45,50.04 | 16.13,52.07 16.13,52.45 | 16.26,52.32 16.38,52.2 | 17.65,52.2 18.03,52.2
  Bottom 0.305: v16.64,44.07 16.64,47.24 15.49,48.39 15.37,48.39 14.61,49.15 v14.61,49.4
VBATT  (via drill 0.41)
  Bottom 0.406: C17.1 20.83,7.24 v20.83,5.84
  pour Top (rank 4): 17.78,13.72 17.78,0.51 43.69,0.51 43.69,13.72
VOUT
  pour Bottom (rank 2): 33.78,15.24 43.69,15.24 43.69,0.51 33.78,0.51
VPP
  pour Top (rank 3): 11.43,14.73 11.43,17.27 26.92,32.77 26.92,56.64 43.94,56.64 43.94,14.73

### Text on the board
tPlace: ON to Enable: / 1)ATm32U4 Bootloader / 2)RPi->ATm32U4 SPI
tNames: PiCar Control Board / v2.1 - June 2017 / WashU ESE Dept